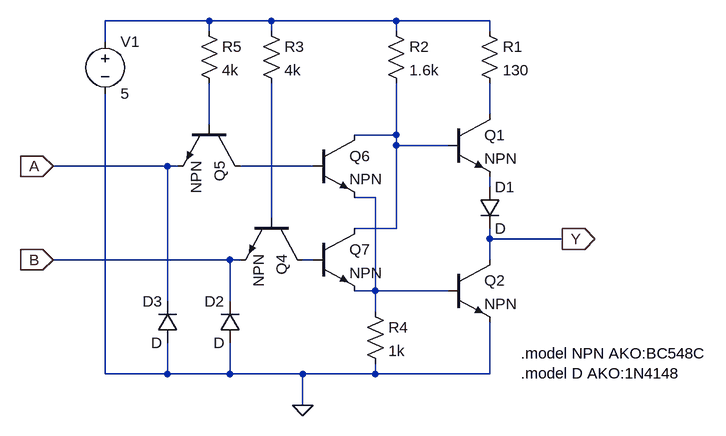
[diagram p0: schematic NOR.asc]
NOR.asc, the LTspice schematic file:
Version 4
SHEET 1 880 680
WIRE -128 -80 -288 -80
WIRE -32 -80 -128 -80
WIRE 160 -80 -32 -80
WIRE 304 -80 160 -80
WIRE -128 -64 -128 -80
WIRE -32 -64 -32 -80
WIRE 160 -64 160 -80
WIRE 304 -64 304 -80
WIRE -288 -48 -288 -80
WIRE 304 64 304 16
WIRE -128 80 -128 16
WIRE 160 96 160 16
WIRE 160 96 96 96
WIRE 160 112 160 96
WIRE 240 112 160 112
WIRE -192 144 -368 144
WIRE -176 144 -192 144
WIRE 32 144 -80 144
WIRE 304 176 304 160
WIRE 128 192 96 192
WIRE -32 224 -32 16
WIRE 160 240 160 112
WIRE 160 240 96 240
WIRE 304 256 304 240
WIRE 416 256 304 256
WIRE -96 288 -368 288
WIRE -80 288 -96 288
WIRE 32 288 16 288
WIRE 304 288 304 256
WIRE 128 336 128 192
WIRE 128 336 96 336
WIRE 240 336 128 336
WIRE -192 352 -192 144
WIRE -96 352 -96 288
WIRE 128 368 128 336
WIRE -288 464 -288 32
WIRE -192 464 -192 416
WIRE -192 464 -288 464
WIRE -96 464 -96 416
WIRE -96 464 -192 464
WIRE 16 464 -96 464
WIRE 128 464 128 448
WIRE 128 464 16 464
WIRE 304 464 304 384
WIRE 304 464 128 464
WIRE 16 512 16 464
FLAG 16 512 0
FLAG -368 288 B
IOPIN -368 288 In
FLAG 416 256 Y
IOPIN 416 256 Out
FLAG -368 144 A
IOPIN -368 144 In
SYMBOL npn 240 64 R0
SYMATTR InstName Q1
SYMBOL npn 240 288 R0
SYMATTR InstName Q2
SYMBOL npn 16 224 R90
SYMATTR InstName Q4
SYMBOL res 288 -80 R0
SYMATTR InstName R1
SYMATTR Value 130
SYMBOL res 144 -80 R0
SYMATTR InstName R2
SYMATTR Value 1.6k
SYMBOL res -48 -80 R0
SYMATTR InstName R3
SYMATTR Value 4k
SYMBOL res 112 352 R0
SYMATTR InstName R4
SYMATTR Value 1k
SYMBOL diode 288 176 R0
SYMATTR InstName D1
SYMBOL diode -80 416 R180
WINDOW 0 24 64 Left 2
WINDOW 3 24 0 Left 2
SYMATTR InstName D2
SYMBOL voltage -288 -64 R0
WINDOW 123 0 0 Left 2
WINDOW 39 0 0 Left 2
SYMATTR InstName V1
SYMATTR Value 5
SYMBOL npn -80 80 R90
SYMATTR InstName Q5
SYMBOL diode -176 416 R180
WINDOW 0 24 64 Left 2
WINDOW 3 24 0 Left 2
SYMATTR InstName D3
SYMBOL res -144 -80 R0
SYMATTR InstName R5
SYMATTR Value 4k
SYMBOL npn 32 96 R0
SYMATTR InstName Q6
SYMBOL npn 32 240 R0
SYMATTR InstName Q7
TEXT 352 432 Left 2 !.model NPN AKO:BC548C\n.model D AKO:1N4148

The netlist it stands for:
* NOR.asc
Q1 N002 N004 N006 0 NPN
Q2 Y N007 0 0 NPN
Q4 N009 N008 B 0 NPN
R1 N001 N002 130
R2 N001 N004 1.6k
R3 N001 N008 4k
R4 N007 0 1k
D1 N006 Y D
D2 0 B D
V1 N001 0 5
Q5 N005 N003 A 0 NPN
D3 0 A D
R5 N001 N003 4k
Q6 N004 N005 N007 0 NPN
Q7 N004 N009 N007 0 NPN
.model D D
.lib standard.dio
.model NPN NPN
.model PNP PNP
.lib standard.bjt
.model NPN AKO:BC548C
.model D AKO:1N4148
.backanno
.end